# EAGLE schematic FlightComputer_RevA (EAGLE 9.0.1)
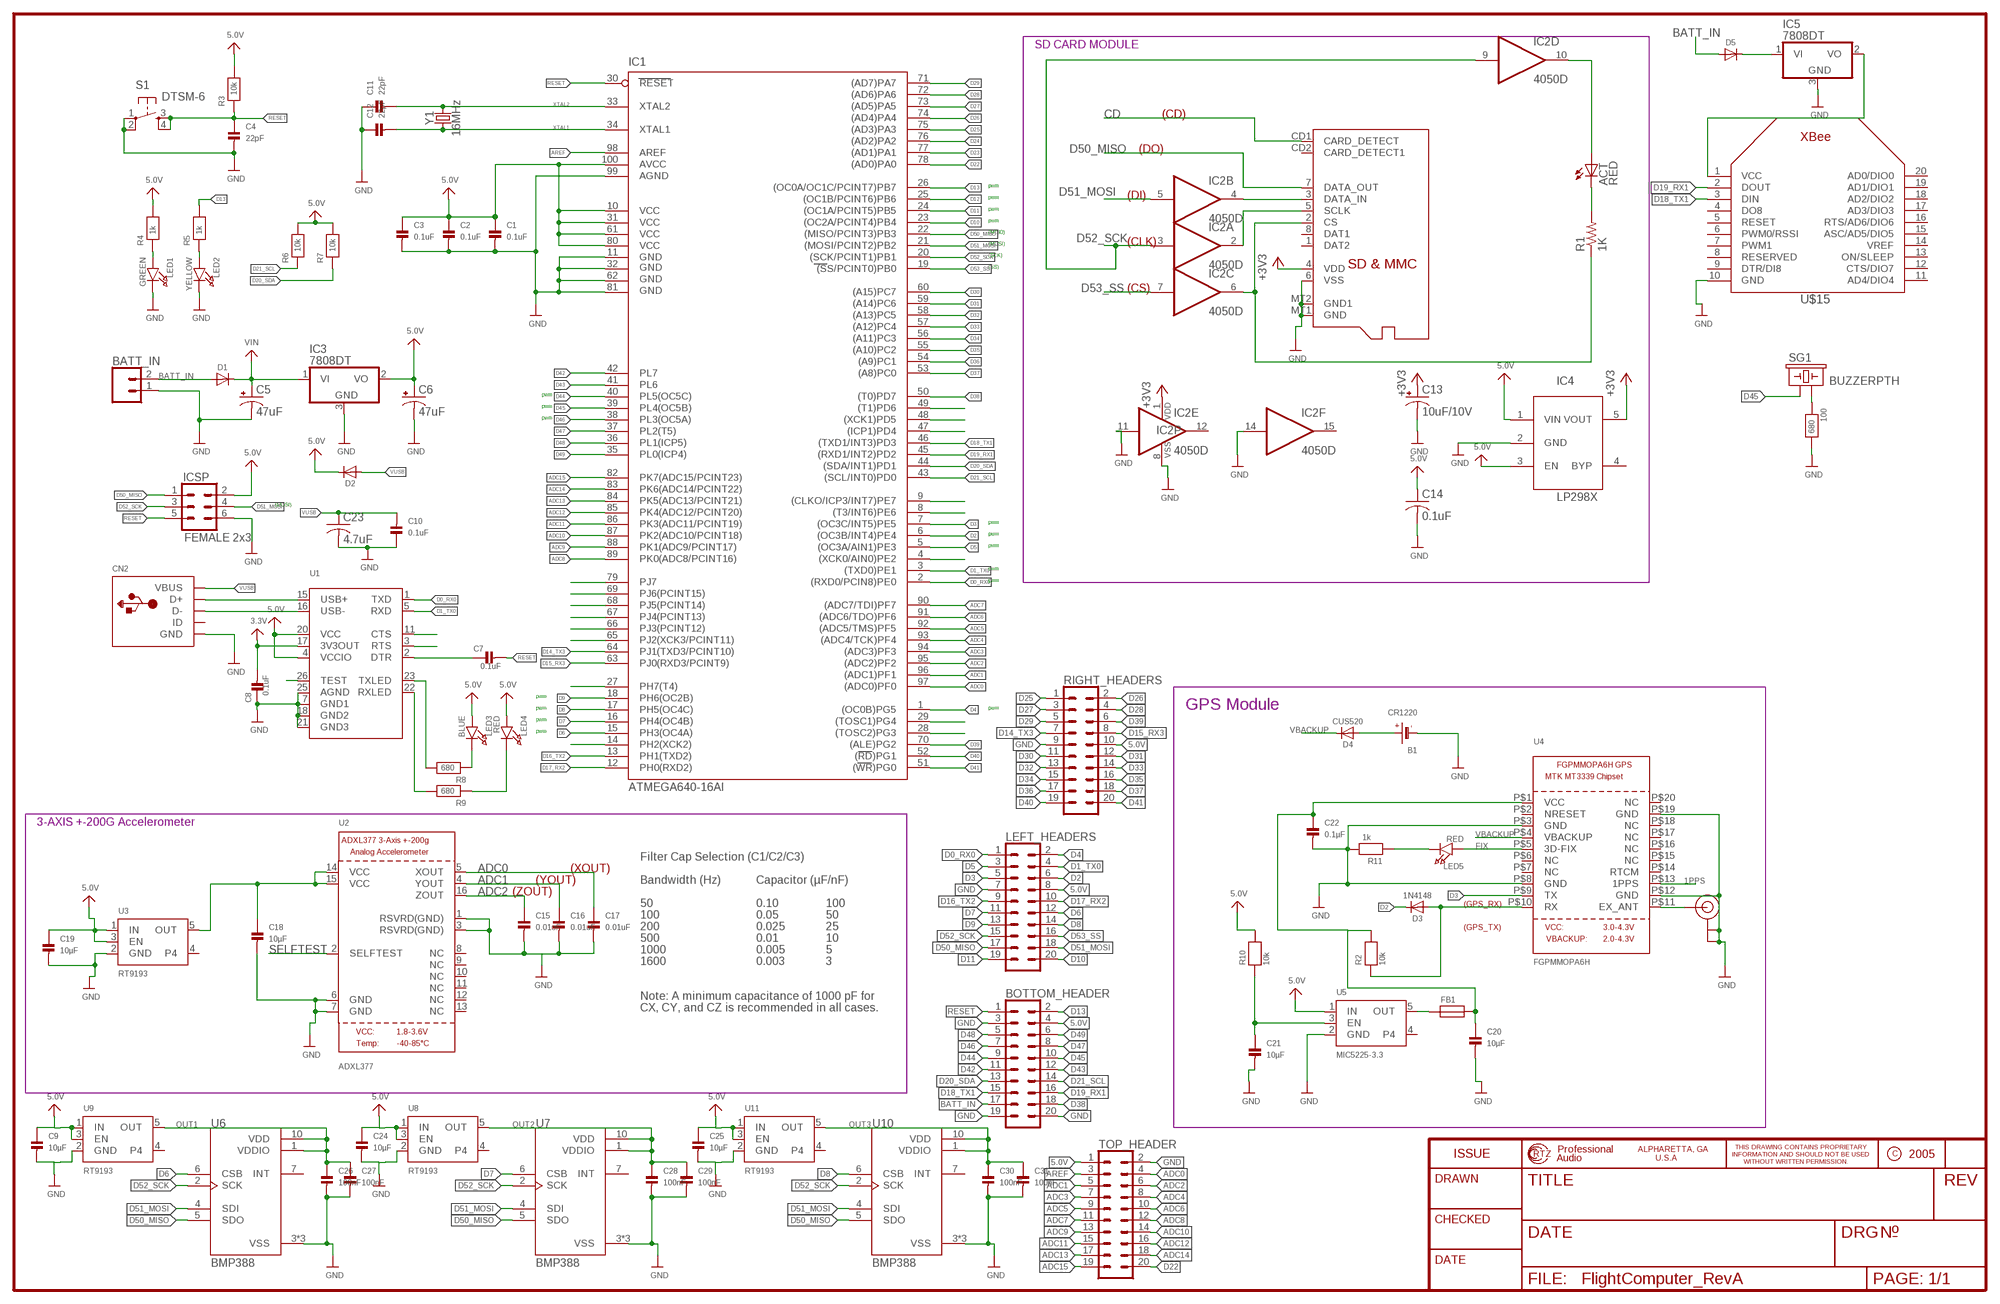
[diagram p0: schematic, sheet 1]

## Parts
100  680  RESISTOR0603  [0603]
ACT  RED  LEDCHIP-LED0805  [CHIP-LED0805]
B1  CR1220  BATTERYCR1220_SMT  [CR1220]
BATT_IN  CONN_02  [1X02]
BOTTOM_HEADER  CONN_10X2  [2X10]
C1  0.1uF  CAP_CERAMIC0603  [0603]
C2  0.1uF  CAP_CERAMIC0603  [0603]
C3  0.1uF  CAP_CERAMIC0603  [0603]
C4  22pF  CAP_CERAMIC0603  [0603]
C5  47uF  CPOL-USD  [PANASONIC_D]
C6  47uF  CPOL-USD  [PANASONIC_D]
C7  0.1uF  CAP_CERAMIC0603  [0603]
C8  0.1uF  CAP_CERAMIC0603  [0603]
C9  10µF  CAP_CERAMIC0603  [0603]
C10  0.1uF  CAP_CERAMIC0603  [0603]
C11  22pF  CAP_CERAMIC0603  [0603]
C12  22pF  CAP_CERAMIC0603  [0603]
C13  10uF/10V  CPOL-USA/3216-18R  [A/3216-18R]
C14  0.1uF  C-USC0805K  [C0805K]
C15  0.01uF  CAP_CERAMIC0603  [0603]
C16  0.01uF  CAP_CERAMIC0603  [0603]
C17  0.01uF  CAP_CERAMIC0603  [0603]
C18  10µF  CAP_CERAMIC0603  [0603]
C19  10µF  CAP_CERAMIC0603  [0603]
C20  10µF  CAP_CERAMIC0603  [0603]
C21  10µF  CAP_CERAMIC0603  [0603]
C22  0.1µF  CAP_CERAMIC0603  [0603]
C23  4.7uF  C-USC0603  [C0603]
C24  10µF  CAP_CERAMIC0603  [0603]
C25  10µF  CAP_CERAMIC0603  [0603]
C26  100nF  CAP_CERAMIC0603  [0603]
C27  100nF  CAP_CERAMIC0603  [0603]
C28  100nF  CAP_CERAMIC0603  [0603]
C29  100nF  CAP_CERAMIC0603  [0603]
C30  100nF  CAP_CERAMIC0603  [0603]
C31  100nF  CAP_CERAMIC0603  [0603]
CN2  USBMINIB  [USB-MINIB]
D1  DIODESOD-123  [SOD-123]
D2  DIODESOD-123  [SOD-123]
D3  1N4148  DIODESOD-323  [SOD-323]
D4  CUS520  DIODESOD-323  [SOD-323]
D5  DIODESOD-123  [SOD-123]
FB1  FERRITE  [0603]
IC1  ATMEGA640-16AI  [TQFP100]
IC2  4050D  [SO16]
IC3  7808DT  [TO252]
IC4  LP298XS  [SOT23-5L]
IC5  7808DT  [TO252]
ICSP  FEMALE 2x3  CONN_03X2FEMALE  [2X3]
LED1  GREEN  LED0603  [CHIPLED_0603]
LED2  YELLOW  LED0603  [CHIPLED_0603]
LED3  BLUE  LED0603  [CHIPLED_0603]
LED4  RED  LED0603  [CHIPLED_0603]
LED5  RED  LED0805  [CHIPLED_0805]
LEFT_HEADERS  CONN_10X2  [2X10]
R1  1K  R-US_R0805  [R0805]
R2  10k  RESISTOR0603  [0603]
R3  10k  RESISTOR0603  [0603]
R4  1k  RESISTOR0603  [0603]
R5  1k  RESISTOR0603  [0603]
R6  10k  RESISTOR0603  [0603]
R7  10k  RESISTOR0603  [0603]
R8  680  RESISTOR0603  [0603]
R9  680  RESISTOR0603  [0603]
R10  10k  RESISTOR0603  [0603]
R11  1k  RESISTOR0603  [0603]
RIGHT_HEADERS  CONN_10X2  [2X10]
S1  DTSM-6  [DTSM-6]
SG1  BUZZERPTH  [BUZZER-12MM]
TOP_HEADER  CONN_10X2  [2X10]
U1  FT232RLSSOP28  [SSOP28DB]
U2  ADXL377  ACCEL_ADXL377  [LFCSP16_LQ]
U3  RT9193  VREG_SOT23-5  [SOT23-5]
U4  FGPMMOPA6H  GPS_FGPMMOPA6H  [FGPMMOPA6H]
U5  MIC5225-3.3  VREG_SOT23-5  [SOT23-5]
U6  BMP388  [PQFN50P200X200X80-10N]
U7  BMP388  [PQFN50P200X200X80-10N]
U8  RT9193  VREG_SOT23-5  [SOT23-5]
U9  RT9193  VREG_SOT23-5  [SOT23-5]
U10  BMP388  [PQFN50P200X200X80-10N]
U11  RT9193  VREG_SOT23-5  [SOT23-5]
U$15  XBEE  [XBEE]
U$55  U.FL  [U.FL]
X1  MICROSD  [MICROSD]
Y1  16MHz  CRYSTAL-16MHZPTH-HC49US  [HC49US]

## Nets
1PPS: U4.P$13(1PPS)
3.3V: C8.2 U1.17(3V3OUT)
5.0V: BOTTOM_HEADER.4 C1.1 C2.1 C3.1 C6.+ C9.1 C14.1 C19.1 C24.1 C25.1 D2.C IC1.10(VCC) IC1.31(VCC1) IC1.61(VCC2) IC1.80(VCC3) IC1.100(AVCC) IC3.2(VO) IC4.1(VIN) IC4.3(EN) ICSP.2 LED3.A LED4.A LEFT_HEADERS.8 R3.2 R4.2 R6.2 R7.2 R10.2 RIGHT_HEADERS.10 TOP_HEADER.1 U1.4(VCCIO) U1.20(VCC) U3.1(IN) U3.3(EN) U5.1(IN) U8.1(IN) U8.3(EN) U9.1(IN) U9.3(EN) U11.1(IN) U11.3(EN)
+3V3: C13.+ IC2.1(P:VDD) IC4.5(VOUT) X1.4(VDD)
ADC0: C17.1 IC1.97((ADC0)PF0) TOP_HEADER.4 U2.5(XOUT)
ADC1: C16.1 IC1.96((ADC1)PF1) TOP_HEADER.5 U2.4(YOUT)
ADC2: C15.1 IC1.95((ADC2)PF2) TOP_HEADER.6 U2.16(ZOUT)
ADC3: IC1.94((ADC3)PF3) TOP_HEADER.7
ADC4: IC1.93((ADC4/TCK)PF4) TOP_HEADER.8
ADC5: IC1.92((ADC5/TMS)PF5) TOP_HEADER.9
ADC6: IC1.91((ADC6/TDO)PF6) TOP_HEADER.10
ADC7: IC1.90((ADC7/TDI)PF7) TOP_HEADER.11
ADC8: IC1.89(PK0(ADC8/PCINT16)) TOP_HEADER.12
ADC9: IC1.88(PK1(ADC9/PCINT17)) TOP_HEADER.13
ADC10: IC1.87(PK2(ADC10/PCINT18)) TOP_HEADER.14
ADC11: IC1.86(PK3(ADC11/PCINT19)) TOP_HEADER.15
ADC12: IC1.85(PK4(ADC12/PCINT20)) TOP_HEADER.16
ADC13: IC1.84(PK5(ADC13/PCINT21)) TOP_HEADER.17
ADC14: IC1.83(PK6(ADC14/PCINT22)) TOP_HEADER.18
ADC15: IC1.82(PK7(ADC15/PCINT23)) TOP_HEADER.19
AREF: IC1.98(AREF) TOP_HEADER.3
BATT_IN: BATT_IN.2 BOTTOM_HEADER.17 D1.A D5.A
CD: X1.CD1(CARD_DETECT)
D0_RX0: IC1.2((RXD0/PCIN8)PE0) LEFT_HEADERS.1 U1.1(TXD)
D1_TX0: IC1.3((TXD0)PE1) LEFT_HEADERS.4 U1.5(RXD)
D2: D3.C IC1.6((OC3B/INT4)PE4) LEFT_HEADERS.6
D3: IC1.7((OC3C/INT5)PE5) LEFT_HEADERS.5 U4.P$9(TX)
D4: IC1.1((OC0B)PG5) LEFT_HEADERS.2
D5: IC1.5((OC3A/AIN1)PE3) LEFT_HEADERS.3
D6: IC1.15(PH3(OC4A)) LEFT_HEADERS.12 U6.6(CSB)
D7: IC1.16(PH4(OC4B)) LEFT_HEADERS.11 U7.6(CSB)
D8: IC1.17(PH5(OC4C)) LEFT_HEADERS.14 U10.6(CSB)
D9: IC1.18(PH6(OC2B)) LEFT_HEADERS.13
D10: IC1.23((OC2A/PCINT4)PB4) LEFT_HEADERS.20
D11: IC1.24((OC1A/PCINT5)PB5) LEFT_HEADERS.19
D12: IC1.25((OC1B/PCINT6)PB6)
D13: BOTTOM_HEADER.2 IC1.26((OC0A/OC1C/PCINT7)PB7) R5.2
D14_TX3: IC1.64(PJ1(TXD3/PCINT10)) RIGHT_HEADERS.7
D15_RX3: IC1.63(PJ0(RXD3/PCINT9)) RIGHT_HEADERS.8
D16_TX2: IC1.13(PH1(TXD2)) LEFT_HEADERS.9
D17_RX2: IC1.12(PH0(RXD2)) LEFT_HEADERS.10
D18_TX1: BOTTOM_HEADER.15 IC1.46((TXD1/INT3)PD3) U$15.3(DIN)
D19_RX1: BOTTOM_HEADER.16 IC1.45((RXD1/INT2)PD2) U$15.2(DOUT)
D20_SDA: BOTTOM_HEADER.13 IC1.44((SDA/INT1)PD1) R7.1
D21_SCL: BOTTOM_HEADER.14 IC1.43((SCL/INT0)PD0) R6.1
D22: IC1.78((AD0)PA0) TOP_HEADER.20
D23: IC1.77((AD1)PA1)
D24: IC1.76((AD2)PA2)
D25: IC1.75((AD3)PA3) RIGHT_HEADERS.1
D26: IC1.74((AD4)PA4) RIGHT_HEADERS.2
D27: IC1.73((AD5)PA5) RIGHT_HEADERS.3
D28: IC1.72((AD6)PA6) RIGHT_HEADERS.4
D29: IC1.71((AD7)PA7) RIGHT_HEADERS.5
D30: IC1.60((A15)PC7) RIGHT_HEADERS.11
D31: IC1.59((A14)PC6) RIGHT_HEADERS.12
D32: IC1.58((A13)PC5) RIGHT_HEADERS.13
D33: IC1.57((A12)PC4) RIGHT_HEADERS.14
D34: IC1.56((A11)PC3) RIGHT_HEADERS.15
D35: IC1.55((A10)PC2) RIGHT_HEADERS.16
D36: IC1.54((A9)PC1) RIGHT_HEADERS.17
D37: IC1.53((A8)PC0) RIGHT_HEADERS.18
D38: BOTTOM_HEADER.18 IC1.50((T0)PD7)
D39: IC1.70((ALE)PG2) RIGHT_HEADERS.6
D40: IC1.52((RD)PG1) RIGHT_HEADERS.19
D41: IC1.51((WR)PG0) RIGHT_HEADERS.20
D42: BOTTOM_HEADER.11 IC1.42(PL7)
D43: BOTTOM_HEADER.12 IC1.41(PL6)
D44: BOTTOM_HEADER.9 IC1.40(PL5(OC5C))
D45: BOTTOM_HEADER.10 IC1.39(PL4(OC5B)) SG1.+
D46: BOTTOM_HEADER.7 IC1.38(PL3(OC5A))
D47: BOTTOM_HEADER.8 IC1.37(PL2(T5))
D48: BOTTOM_HEADER.5 IC1.36(PL1(ICP5))
D49: BOTTOM_HEADER.6 IC1.35(PL0(ICP4))
D50_MISO: IC1.22((MISO/PCINT3)PB3) ICSP.1 LEFT_HEADERS.17 U6.5(SDO) U7.5(SDO) U10.5(SDO) X1.7(DATA_OUT)
D51_MOSI: IC1.21((MOSI/PCINT2)PB2) IC2.5(B:I) ICSP.4 LEFT_HEADERS.18 U6.4(SDI) U7.4(SDI) U10.4(SDI)
D52_SCK: IC1.20((SCK/PCINT1)PB1) IC2.3(A:I) IC2.9(D:I) ICSP.3 LEFT_HEADERS.15 U6.2(SCK) U7.2(SCK) U10.2(SCK)
D53_SS: IC1.19((SS/PCINT0)PB0) IC2.7(C:I) LEFT_HEADERS.16
FIX: LED5.A U4.P$5(3D-FIX)
GND: 100.2 B1.- BATT_IN.1 BOTTOM_HEADER.3 BOTTOM_HEADER.19 BOTTOM_HEADER.20 C1.2 C2.2 C3.2 C4.2 C5.- C6.- C8.1 C9.2 C10.1 C11.1 C12.1 C13.- C14.2 C15.2 C16.2 C17.2 C18.2 C19.2 C20.2 C21.2 C22.2 C23.2 C24.2 C25.2 C26.2 C27.2 C28.2 C29.2 C30.2 C31.2 CN2.GND IC1.11(GND) IC1.32(GND1) IC1.62(GND2) IC1.81(GND3) IC1.99(AGND) IC2.8(P:VSS) IC2.11(E:I) IC2.14(F:I) IC3.3(GND) IC4.2(GND) IC5.3(GND) ICSP.6 LED1.C LED2.C LEFT_HEADERS.7 R11.2 RIGHT_HEADERS.9 S1.1 S1.2 TOP_HEADER.2 U1.7(GND1) U1.18(GND2) U1.21(GND3) U1.25(AGND) U2.1(RSVRD(GND)) U2.3(RSVRD(GND)) U2.6(GND) U2.7(GND) U3.2(GND) U4.P$3(GND) U4.P$8(GND) U4.P$12(GND) U4.P$19(GND) U5.2(GND) U6.3(VSS) U6.8(VSS) U6.9(VSS) U7.3(VSS) U7.8(VSS) U7.9(VSS) U8.2(GND) U9.2(GND) U10.3(VSS) U10.8(VSS) U10.9(VSS) U11.2(GND) U$15.10(GND) U$55.P$1(GND) U$55.P$2(GND) X1.6(VSS) X1.MT1(GND) X1.MT2(GND1)
N$1: IC1.65(PJ2(XCK3/PCINT11))
N$2: IC1.66(PJ3(PCINT12))
N$3: ACT.A IC2.10(D:O)
N$4: IC1.67(PJ4(PCINT13))
N$5: IC1.68(PJ5(PCINT14))
N$6: IC1.69(PJ6(PCINT15))
N$7: IC1.79(PJ7)
N$8: IC1.27(PH7(T4))
N$9: IC1.9((CLKO/ICP3/INT7)PE7)
N$10: IC1.49((T1)PD6)
N$11: IC1.48((XCK1)PD5)
N$12: IC1.47((ICP1)PD4)
N$13: IC1.14(PH2(XCK2))
N$14: IC1.8((T3/INT6)PE6)
N$15: D5.C IC5.1(VI)
N$16: CN2.D+ U1.15(USB+)
N$17: CN2.D- U1.16(USB-)
N$18: IC1.4((XCK0/AIN0)PE2)
N$19: LED1.A R4.1
N$20: LED2.A R5.1
N$21: LED3.C R8.1
N$22: R9.2 U1.22(RXLED)
N$23: R8.2 U1.23(TXLED)
N$24: LED4.C R9.1
N$25: IC1.29((TOSC1)PG4)
N$26: IC1.28((TOSC2)PG3)
N$27: IC2.2(A:O) X1.5(SCLK)
N$28: U1.26(TEST)
N$29: U1.11(CTS)
N$30: U1.3(RTS)
N$31: C7.1 U1.2(DTR)
N$32: IC2.6(C:O) R1.1 X1.2(CS)
N$33: ACT.C R1.2
N$34: IC2.4(B:O) X1.3(DATA_IN)
N$35: U4.P$11(EX_ANT) U$55.P$3(SIGNAL)
N$36: C18.1 U2.14(VCC) U2.15(VCC) U3.5(OUT)
N$37: C21.1 R10.1 U5.3(EN)
N$38: D3.A R2.1 U4.P$10(RX)
N$39: B1.+$1(+) B1.+$2(+) D4.A
N$40: C20.1 C22.1 FB1.2 R2.2 U4.P$1(VCC)
N$42: 100.1 SG1.-
N$43: LED5.C R11.1
OUT: FB1.1 U5.5(OUT)
OUT1: C26.1 C27.1 U6.1(VDDIO) U6.10(VDD) U9.5(OUT)
OUT2: C28.1 C29.1 U7.1(VDDIO) U7.10(VDD) U8.5(OUT)
OUT3: C30.1 C31.1 U10.1(VDDIO) U10.10(VDD) U11.5(OUT)
RESET: BOTTOM_HEADER.1 C4.1 C7.2 IC1.30(RESET) ICSP.5 R3.1 S1.3 S1.4
SELFTEST: U2.2(SELFTEST)
VBACKUP: D4.C U4.P$4(VBACKUP)
VCC: IC5.2(VO) U$15.1(VCC)
VIN: C5.+ D1.C IC3.1(VI)
VUSB: C10.2 C23.1 CN2.VBUS D2.A
XTAL1: C12.2 IC1.34(XTAL1) Y1.1
XTAL2: C11.2 IC1.33(XTAL2) Y1.2
Unconnected: CN2.ID IC2.12(E:O) IC2.15(F:O) IC4.4(BYP) U2.8(NC) U2.9(NC) U2.10(NC) U2.11(NC) U2.12(NC) U2.13(NC) U3.4 U4.P$2(NRESET) U4.P$6(NC) U4.P$7(NC) U4.P$14(RTCM) U4.P$15(NC) U4.P$16(NC) U4.P$17(NC) U4.P$18(NC) U4.P$20(NC) U5.4 U6.7(INT) U7.7(INT) U8.4 U9.4 U10.7(INT) U11.4 U$15.4(DO8) U$15.5(RESET) U$15.6(PWM0/RSSI) U$15.7(PWM1) U$15.8(RESERVED) U$15.9(DTR/DI8) U$15.11(AD4/DIO4) U$15.12(CTS/DIO7) U$15.13(ON/SLEEP) U$15.14(VREF) U$15.15(ASC/AD5/DIO5) U$15.16(RTS/AD6/DIO6) U$15.17(AD3/DIO3) U$15.18(AD2/DIO2) U$15.19(AD1/DIO1) U$15.20(AD0/DIO0) X1.1(DAT2) X1.8(DAT1) X1.CD2(CARD_DETECT1)

## Notes on the sheet
- SD CARD MODULE
- (CD)
- (DO)
- pwm
- pwm | (DI)
- pwm
- pwm
- (MISO)
- (MOSI) | (CLK)
- (SCK)
- (SS)
- (CS)
- pwm
- pwm
- pwm
- (MOSI)
- pwm
- pwm
- pwm
- pwm
- pwm
- pwm
- pwm | pwm | GPS Module
- pwm
- pwm
- 3-AXIS +-200G Accelerometer
- Filter Cap Selection (C1/C2/C3)
- (XOUT)
- (YOUT) | Bandwidth (Hz) | Capacitor (µF/nF)
- (ZOUT)
- 50 | 0.10 | 100 | (GPS_RX)
- 100 | 0.05 | 50
- 200 | 0.025 | 25 | (GPS_TX)
- 500 | 0.01 | 10
- 1000 | 0.005 | 5
- 1600 | 0.003 | 3
- Note: A minimum capacitance of 1000 pF for
- CX, CY, and CZ is recommended in all cases.

## Library data of the parts
100 R2-R11 = microbuilder:RESISTOR: Resistors 0402 - 0402 Surface Mount Package 22 Ohm 1% 1/16W [Digikey: 311-22.0LRTR-ND] 33 Ohm 5% 1/16W 1.0K 5% 1/16W 1.5K 5% 1/16W 2.0K 1% 1/16W 10.0K 1% 1/16W [Digikey: 311-10.0KLRTR-ND] 10.0K 5% 1/16W [Digikey: RMCF0402JT10K0TR-ND] 12.1K 1% 1/16W [Digikey: 311-22.0LRTR-ND] 100.0K 5% 1/16W 0603 - 0603 Surface Mount Package 0 Ohm 1/10 Watt 1% Resistor 15 Ohm 1/10 Watt 1% Resistor 33 Ohm 1/10 Watt 1% Resistor 49.9 Ohm 1/10 Watt 1% Resistor 100 Ohm 1/10 Watt 1% Resistor 150 Ohm 1/10 Watt 1% Resistor 240 Ohm 1/10 Watt 1% Resistor 390 Ohm 1/10 Watt 1% Resistor 560 Ohm 1/10 Watt 1% Resistor 680 Ohm 1/10 Watt 1% Resistor 750 Ohm 1/10 Watt 1% Resistor 1.0K Ohm 1/10 Watt 1% Resistor 1.5K Ohm 1/10 Watt 1% Resistor 2.0K Ohm 1/10 Watt 1% Resistor 2.2K Ohm 1/10 Watt 1% Resistor 3.3K Ohm 1/10 Watt 1% Resistor 4.7K Ohm 1/10 Watt 1% Resistor 10.0K Ohm 1/10 Watt 1% Resistor 12.0K Ohm 1/10 Watt 1% Resistor 12.1K Ohm 1/10 Watt 1% Resistor 20.0K Ohm 1/10 Watt 1% Resistor 33.0K Ohm 1/10 Watt 1% Resistor 100.0K Ohm 1/10 Watt 1% Resistor 0805 - 0805 Surface Mount Package 0 Ohm 1/8 Watt 1% Resistor 33 Ohm 1/8 Watt 1% Resistor 100 Ohm 1/8 Watt 1% Resistor 150 Ohm 1/8 Watt 1% Resistor 200 Ohm 1/8 Watt 1% Resistor 240 Ohm 1/8 Watt 1% Resistor 330 Ohm 1/8 Watt 1% Resistor 390 Ohm 1/8 Watt 1% Resistor 470 Ohm 1/8 Watt 1% Resistor 1.0K Ohm 1/8 Watt 1% Resistor 1.5K Ohm 1/8 Watt 1% Resistor 2.0K Ohm 1/8 Watt 1% Resistor 4.7K Ohm 1/8 Watt 1% Resistor 5.1K Ohm 1/8 Watt 1% Resistor 5.6K Ohm 1/8 Watt 1% Resistor 10.0K Ohm 1/8 Watt 1% Resistor 22.0K Ohm 1/8 Watt 1% Resistor 33.0K Ohm 1/8 Watt 1% Resistor 100K Ohm 1/8 Watt 1% Resistor 1206 - 1206 Surface Mount Package 2012 - 2010 Surface Mount Package 0.11 Ohm 1/2 Watt 1% Resistor - Digikey: RHM.11UCT-ND
ACT = adafruit:LED: LED
B1 = microbuilder:BATTERY: CR1220 SMT - Digikey: 3001K-ND CD2032 BAT-HLD-001 - Digikey: BAT-HLD-001-ND
BATT_IN = SparkFun-Connectors:CONN_02: Multi connection point. Often used as Generic Header-pin footprint for 0.1 inch spaced/style header connections On any of the 0.1 inch spaced packages, you can populate with these: Break Away Headers - Straight <https://www.sparkfun.com/products/116> (PRT-00116) Break Away Male Headers - Right Angle <https://www.sparkfun.com/products/553> (PRT-00553) Female Headers <https://www.sparkfun.com/products/115> (PRT-00115) Break Away Headers - Machine Pin <https://www.sparkfun.com/products/117> (PRT-00117) Break Away Female Headers - Swiss Machine Pin <https://www.sparkfun.com/products/743> (PRT-00743) For SCREWTERMINALS and SPRING TERMINALS visit here: Screw Terimnals on SparkFun.com <https://www.sparkfun.com/search/results?term=Screw+Terminals> (5mm/3.5mm/2.54mm spacing) This device is also useful as a general connection point to wire up your design to another part of your project. Our various solder wires solder well into these plated through hole pads. Hook-Up Wire - Assortment (Stranded, 22 AWG) <https://www.sparkfun.com/products/11375> (PRT-11375) Hook-Up Wire - Assortment (Solid Core, 22 AWG) <https://www.sparkfun.com/products/11367> (PRT-11367) View the entire wire category on our website here <https://www.sparkfun.com/categories/141> Special notes: Molex polarized connector foot print use with: PRT-08233 with associated crimp pins and housings. 2.54_SCREWTERM for use with PRT-10571. 3.5mm Screw Terminal footprints for PRT-08084 5mm Screw Terminal footprints for use with PRT-08432
BOTTOM_HEADER LEFT_HEADERS RIGHT_HEADERS TOP_HEADER = SparkFun-Connectors:CONN_10X2: Multi connection point. Often used as Generic Header-pin footprint for 0.1 inch spaced/style header connections On any of the 0.1 inch spaced packages, you can populate with these: Break Away Headers - Straight <https://www.sparkfun.com/products/116> (PRT-00116) Break Away Male Headers - Right Angle <https://www.sparkfun.com/products/553> (PRT-00553) Female Headers <https://www.sparkfun.com/products/115> (PRT-00115) Break Away Headers - Machine Pin <https://www.sparkfun.com/products/117> (PRT-00117) Break Away Female Headers - Swiss Machine Pin <https://www.sparkfun.com/products/743> (PRT-00743) Special note about the "SPECIAL" package: This was SPECIALLY designed to be used with our Graphic LCD Backpack. Be sure you want to use this! It is not only staggered on each line of header holes, but IT IS ALSO offset of the center point of the top and bottom lines by 5 mil. This causes the headers to lock into place on the "standard" footprint on the LCD screen. The extra squares on the tdocu layer are there simply to reference other pins (if you were to actually populate a longer header than ten long - this is what we do with the backpacks).
C1-C4 C7-C12 C15-C22 C24-C31 = microbuilder:CAP_CERAMIC: Ceramic Capacitors 0402 - 0402 Surface Mount Capacitors 16pF 50V 5% [Digikey: 445-4899-2-ND] 18pF 50V 5% [Digikey: 490-1281-2-ND] 22pF 50V 5% [Digikey: 490-1283-2-ND] 68pF 50V 5% [Digikey: 490-1289-2-ND] 0.1uF 10V 10% [Digikey: 490-1318-2-ND] 1.0uF 6.3V 10% [Digikey: 490-1320-2-ND] 0603 - 0603 Surface Mount Capacitors 16 pF 50V 5% [Digikey: 445-5051-2-ND] 22 pF 50V [Digikey: PCC220ACVTR-ND] 33 pF 50V 5% [Digikey: 490-1415-1-ND] 56pF 50V 5% [Digikey: 490-1421-1-ND] 220pF 50V 5% [Digikey: 445-1285-1-ND] 680 pF 50V 2200 pF 50V 5% C0G [Digikey: 445-1297-1-ND] 5600 pF 100V 5% X7R [Digikey: 478-3711-1-ND] 0.1 µF 25V 10% [Digikey: PCC2277TR-ND] 0.22 µF 16V 10% X7R [Digikey: 445-1318-1-ND] 1.0 µF 25V 10% [Digikey: 445-5146-2-ND] 0603 - RF Specific 3pF 250V +/-0.1pF RF [Digikey: 712-1347-1-ND] 18 pF 250V 5% [Digikey: 478-3505-1-ND or 712-1322-1-ND] 56 pF 250V 5% C0G RF [Digikey: 490-4867-1-ND] 68 pF 250V RF [Digikey: 490-4868-1-ND] 0805 - 0805 Surface Mount Capacitors 220 pF 250V 2% RF Ceramic Capacitor [Digikey: 712-1398-1-ND] 1000 pF 50V 2% NP0 Ceramic Capacitor [Digikey: 478-3760-1-ND] 0.1 µF 25V 10% Ceramic Capacitor [Digikey: PCC1828TR-ND] 1.0 µF 16V 10% Ceramic Capacitor[Digikey: 490-1691-2-ND] 10.0 µF 10V 10% Ceramic Capacitor[Digikey: 709-1228-1-ND] 10.0 uF 16V 10% Ceramic Capacitor [Digikey: 478-5165-2-ND] 47 uF 6.3V 20% Ceramic Capacitor [Digikey: 587-1779-1-ND or 399-5506-1-ND] 1206 - 1206 Surface Mount Capacitors 47uF 10V 20% Ceramic Capacitor [Digikey: 490-5528-1-ND or 399-5508-1-ND or 445-6010-1-ND]
C5 C6 = rcl:CPOL-US: POLARIZED CAPACITOR, American symbol; SPICEPREFIX: C
C13 = adafruit:CPOL-US: POLARIZED CAPACITOR, American symbol
C14 C23 = adafruit:C-US: CAPACITOR, American symbol
CN2 = adafruit:USB: USB Connectors USBMINIB - Surface Mount Female Mini-B USB Connector 4UConnector: 06564 By microbuilder.eu Thru-hole RA Female Mini-B USB Connector 4UConnector: 18732 By ladyada.net
D1-D5 = microbuilder:DIODE: Diode SMA Model Volts Amps Type Vf Ir Digikey # Notes SSA34-E3 40V 3A Schottky 480mV @ 3A 200uA @ 40V SSA34-E3/61TGITR-ND CDBA120-G 20V 1A Schottky 500mV @ 1A 500uA @ 20V 641-1014-6-ND REEL MBRA210 10V 2A Schottky 350mV @ 2A 700uA @ 10V MBRA210LT3 SOD-123 Model Volts Amps Type Vf Ir Order # Notes BAT54T1G 30V 200mA Schottky 800mV @ 200mA 2uA @ 25V BAT54T1GOSTR-ND B0530W 30V 500mA Schottky 430mV @ 500mA 130uA @ 30V B0530W-FDICT-ND REEL MBR120 20V 1A Schottky 340mV @ 1A MBR120VLSFT1GOSCT-ND SOD-323 Model Volts Amps Type Vf Ir Order # Notes PMEG2005EJ 20V 500mA Schottky 355mV @ 500mA 568-4110-1-ND ZLLS410 10V 570mA Schottky 380mV @ 570mA ZLLS410CT-ND 1N4148WS 75V 150mA Silicon/Simple 1V 1N4148WSFSCT-ND REEL SOD-523 Model Volts Amps Type Vf Ir Order # Notes BAT54XV2 30V 200mA Schottky 0.8V @ 100mA BAT54XV2CT-ND TB751S 30V 30mA Schottky RB751S-40TE61CT-ND SOT23-R/W (R = Solder Paste/Reflow Ovens, W = Hand-Soldering) Model Volts Amps Type Vf Ir Order # Notes BAT54FILM 40V 300mA Schottky 497-7162-1-ND POWERDI-5 Model Volts Amps Type Vf Ir Order # Notes PDS560 60V 5A Schottky 670mV @ 5A 150uA @ 60V PDS560DICT-ND
FB1 = microbuilder:FERRITE: Ferrite Bead 0603 MMZ1608B121C - 120 Ohm, 600mA Ferrite Chip - Digikey: 445-2164-1-ND BK1608HW121-T - 120 Ohm, 600mA Ferrite Chip - Digikey: 587-1876-2-ND
IC1 = atmel-2005:ATMEGA*: MICROCONTROLLER 64/128/256 Kbytes FLASH 4 Kbytes EEPROM 8 Kbytes SRAM 86 General Purpose I/O pins 12-channels16-bit PWM 4 x Serial USARTs 16-channels 10-bit A/D
IC2 = 40xx:4050: Hex non-inverting BUFFER
IC3 IC5 = adafruit:78*: Positive VOLTAGE REGULATOR Added bigger pads to the TO-92 package
IC4 = adafruit:LP298X
ICSP = SparkFun-Connectors:CONN_03X2: Multi connection point. Often used as Generic Header-pin footprint for 0.1 inch spaced/style header connections You can populate with any combo of single row headers, but if you'd like an exact match, check these: Header - 2x3 (Male, 0.1") <https://www.sparkfun.com/products/12807> (PRT-12807) Header - 2x3 (Female, 0.1") <https://www.sparkfun.com/products/13010> (PRT-13010) 2x3 Pin Shrouded Header <https://www.sparkfun.com/products/10877> (PRT-10877) On any of the 0.1 inch spaced packages, you can populate with these: Break Away Headers - Straight <https://www.sparkfun.com/products/116> (PRT-00116) Break Away Male Headers - Right Angle <https://www.sparkfun.com/products/553> (PRT-00553) Female Headers <https://www.sparkfun.com/products/115> (PRT-00115) Break Away Headers - Machine Pin <https://www.sparkfun.com/products/117> (PRT-00117) Break Away Female Headers - Swiss Machine Pin <https://www.sparkfun.com/products/743> (PRT-00743) Special note: the shrouded connector mates well with our 3x2 ribbon cables: Ribbon Crimp Connector - 6-pin (2x3, Female) <https://www.sparkfun.com/products/10651> (PRT-10651) Ribbon Cable - 6 wire (15ft) <https://www.sparkfun.com/products/10646> (PRT-10646); PROD_ID: CONN-11566
LED1-LED5 = microbuilder:LED: LED
R1 = adafruit:R-US_: RESISTOR, American symbol
S1 = switch-tact:DTSM-6
SG1 = SparkFun:BUZZER: Buzzer 12mm Spark Fun Electronics SKU : Comp-Buzzer
U1 = microbuilder:FT232RL: FTDI FT232RL USB TO RS232 Converter Digikey: 768-1007-1-ND
U2 = microbuilder:ACCEL_ADXL377: ADXL377 +/-200g 3-Axis Analog Accelerometer VCC: 1.8-3.6V
U3 U5 U8 U9 U11 = microbuilder:VREG_SOT23-5: SOT23-5 Fixed Voltage Regulators Part Current Out V Out V In V Dropout θJA (°C/W) TJ (°C) Digikey Part No. ADP121 150mA 3.3V 3.4-5.5V 0.09V @ 150mA -- -- ADP121-AUJZ33R7CT-ND ADP121 150mA 3.0V 3.1-5.5V 0.09V @ 150mA -- -- ADP121-AUJZ30R7CT-ND ADP122 300mA 3.3V 3.4-5.5V 0.085V @ 300mA -- -- ADP122AUJZ-3.3-R7CT-ND ADP1712 300mA 3.3V 3.5-5.5V 0.17V @ 300mA -- -- ADP1712AUJZ-3.3-R7TR-ND AP7311 (Low Cost) 150mA 3.3V 3.5-6V 0.15V @ 150mA -- -- AP7311-33WG-7DICT-ND LD39015M18R 150mA 1.8V 1.9V-5.5V 0.08V @ 100mA -- -- 497-6977-1-ND LP2985A-33DBVR 150mA 3.3V 3.3-16V 0.28V @ 150mA 206 150 296-18479-1-ND MCP1824T-3302E/OT 300mA 3.3V 3.5V-6V 0.2V @ 300mA -- -- MCP1824T-3302E/OTCT-ND MIC5205-2.5YM5 TR 150mA 2.5V 2.7-16V 0.165V @ 150mA -- -- 576-1257-2-ND MIC5205-3.0YM5 TR 150mA 3.0V 3.2V-16V 0.165V @ 150mA -- -- 576-1258-2-ND MIC5205-3.3YM5 TR 150mA 3.3V 3.5V-16V 0.165V @ 150mA -- -- 576-1259-2-ND TPS780330220 150mA 3.3V+2.2V 3.6-5.5V 250mV Max -- -- 296-23332-1-ND TDA3663/N1,135 100mA 3.3V 3.5-45V 0.18V @ 50mA -- -- 568-5343-1-ND Max operating temp can be calculated using θJA, TJ (max junction temperature), and power in watts. Set the "Maximum Ambient Temperature" until it reaches TJ ("Max Junction Temperature"), which is the absolute limit for safe use of the regulator: Heat Sink Temperature Calculator <http://www.daycounter.com/Calculators/Heat-Sink-Temperature-Calculator.phtml> For example, With 12V source into a 3.3V LP2985 and a 30mA load, we are dissipating (12V-3.3V) * 0.03A = 0.261W. With a θJA of 206 °C/W, a TJ of 150°C, and 261mW we can safely use the chip without a heat sink up to 75°C (=147.1°C Junction Temperature).
U4 = microbuilder:GPS_FGPMMOPA6H: GPS Module - MTK MT3339 Chipset, -165dBm sensitivity, 22 channels, 10Hz, auto-select external antenna options
U6 U7 U10 = BMP388:BMP388: P-Sensor SPI I2C 1, 25 Bar SMD; AVAILABILITY: Unavailable; DESCRIPTION: P-Sensor SPI I2C 1, 25 Bar SMD; MF: Bosch Sensortec; MP: BMP388; PACKAGE: WFLGA-10 Bosch Tools; PRICE: None
U$15 = adafruit:XBEE
U$55 = microbuilder:U.FL: U.FL Antenna Connector
X1 = adafruit:MICROSD: Micro-SD / Transflash card holder with SPI pinout For the 3M # 2908-05WB-MG and/or 4UCON #19656 push-push type
Y1 = SparkFun-Clocks:CRYSTAL-16MHZ: 16MHz Crystal Digikey Example <http://www.digikey.com/product-search/en?keywords=535-9122-1-ND> Frequency: 16MHz Frequency Stability: ±50ppm Frequency Tolerance: ±20ppm Load Capacitance: 18pF SparkFun Products: Pro Micro -5V/16MHz <https://www.sparkfun.com/products/12640> SparkFun Serial Enabled LCD Kit <https://www.sparkfun.com/products/10097>; PROD_ID: XTAL-08181; SF_ID: COM-00536

## Net classes
0 default: width 0.152 mm